# Altium schematic sheet 01_Top.SchDoc: Overview
size A4; Author: Sasa Karanovic; Organization: Altium Limited; Revision: 04; SheetNumber: 1; SheetTotal: 4; PrjDate: 2023-09-29; PrjTime: 23:04; PrjName: OpenFAN Micro
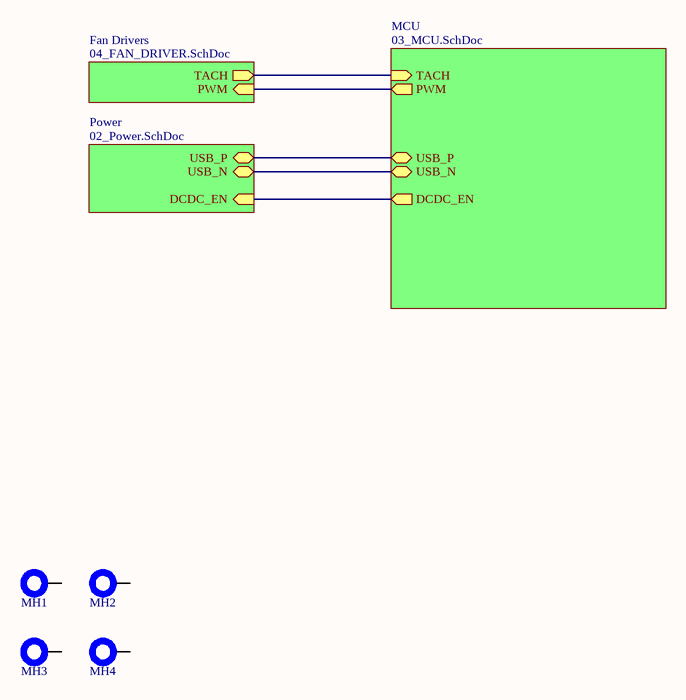
[diagram p0: 01_Top.SchDoc]

## Parts
MH1  Mounting Hole  [MH-M3]  (value not drawn)  (no BOM)
MH2  Mounting Hole  [MH-M3]  (value not drawn)  (no BOM)
MH3  Mounting Hole  [MH-M3]  (value not drawn)  (no BOM)
MH4  Mounting Hole  [MH-M3]  (value not drawn)  (no BOM)

## Sub-sheets
Fan Drivers = 04_FAN_DRIVER.SchDoc: TACH (out), PWM (in)
MCU = 03_MCU.SchDoc: USB_N (bidir), USB_P (bidir), DCDC_EN (out), TACH (in), PWM (out)
Power = 02_Power.SchDoc: USB_N (bidir), USB_P (bidir), DCDC_EN (in)

## Nets
(unnamed): sheet Power/USB_N, sheet MCU/USB_N
(unnamed): sheet Power/USB_P, sheet MCU/USB_P
(unnamed): sheet Power/DCDC_EN, sheet MCU/DCDC_EN
(unnamed): sheet MCU/TACH, sheet Fan Drivers/TACH
(unnamed): sheet MCU/PWM, sheet Fan Drivers/PWM

Not connected (* = marked no-connect by the designer): MH1 0; MH2 0; MH3 0; MH4 0

## Notes on the sheet
- Page:
- Drawn By:
- Project:
- Rev:
- Time:
- Date:
- Sheet
- of

## Library data of the parts
MH1-MH4 = Mounting Hole - M3: Board Mounting Hole